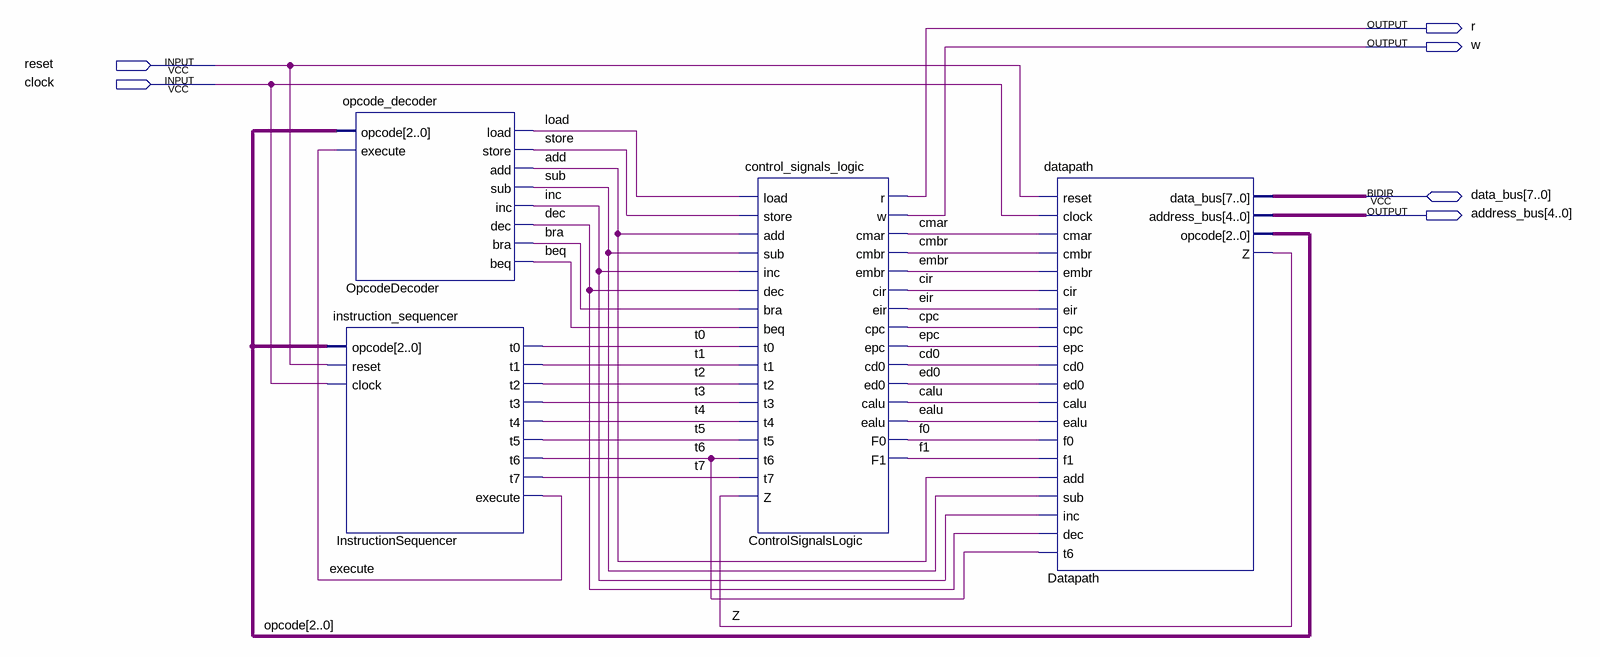
[diagram p0: schematic sheet]
// Quartus schematic simple_cpu.bdf as structural Verilog: 4 symbols, 6 pins
module simple_cpu (
  input  reset,
  input  clock,
  inout  [7:0] data_bus,
  output r,
  output w,
  output [4:0] address_bus
);

  wire add, beq, bra, calu, cd0, cir, cmar, cmbr, cpc, dec, ealu, ed0, eir, embr, epc, execute, f0, f1, inc,
       load, store, sub, t0, t1, t2, t3, t4, t5, t6, t7, Z;
  wire [2:0] opcode;

  opcode_decoder OpcodeDecoder (
    .opcode(opcode), .execute(execute), .load(load), .store(store), .add(add), .sub(sub), .inc(inc),
    .dec(dec), .bra(bra), .beq(beq));
  instruction_sequencer InstructionSequencer (
    .opcode(opcode), .reset(reset), .clock(clock), .t0(t0), .t1(t1), .t2(t2), .t3(t3), .t4(t4), .t5(t5),
    .t6(t6), .t7(t7), .execute(execute));
  control_signals_logic ControlSignalsLogic (
    .load(load), .store(store), .add(add), .sub(sub), .inc(inc), .dec(dec), .bra(bra), .beq(beq), .t0(t0),
    .t1(t1), .t2(t2), .t3(t3), .t4(t4), .t5(t5), .t6(t6), .t7(t7), .Z(Z), .r(r), .w(w), .cmar(cmar),
    .cmbr(cmbr), .embr(embr), .cir(cir), .eir(eir), .cpc(cpc), .epc(epc), .cd0(cd0), .ed0(ed0), .calu(calu),
    .ealu(ealu), .F0(f0), .F1(f1));
  datapath Datapath (
    .reset(reset), .clock(clock), .cmar(cmar), .cmbr(cmbr), .embr(embr), .cir(cir), .eir(eir), .cpc(cpc),
    .epc(epc), .cd0(cd0), .ed0(ed0), .calu(calu), .ealu(ealu), .f0(f0), .f1(f1), .add(add), .sub(sub),
    .inc(inc), .dec(dec), .t6(t6), .address_bus(address_bus), .opcode(opcode), .Z(Z), .data_bus(data_bus));
endmodule
